# Altium schematic sheet Voltage Indicator.SchDoc
size A4; SheetNumber: 1; SheetTotal: 1
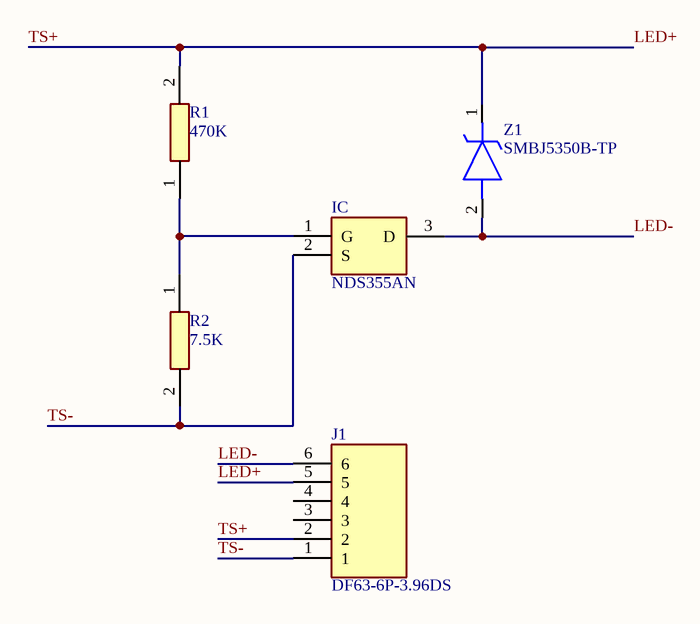
[diagram p0: Voltage Indicator.SchDoc]

## Parts
IC  NDS355AN  [SOT95P251X112-3N]
J1  DF63-6P-3.96DS  [DF636P396DS]
R1  470K  [RESAD1800W63L800D250]
R2  7.5K  [RESAD1800W63L800D250]
Z1  SMBJ5350B-TP  [DIOM5336X261N]

## Nets
LED+: J1.2 J1.5 R1.2 Z1.1(K)  [also labelled TS+]
LED-: IC.3(D) J1.6 Z1.2(A)
TS-: IC.2(S) J1.1 R2.2
NetIC_1: IC.1(G) R1.1 R2.1

Not connected (* = marked no-connect by the designer): J1 3 4

## Library data of the parts
IC = NDS355AN: Integrated Circuit; Manufacturer_Name: onsemi; Datasheet Link: https://www.mouser.de/datasheet/2/308/NDS355AN-D-1813055.pdf; Height: 1.12mm; Manufacturer_Part_Number: NDS355AN; Mouser Part Number: 512-NDS355AN; Mouser Price/Stock: https://www.mouser.co.uk/ProductDetail/ON-Semiconductor-Fairchild/NDS355AN?qs=FOlmdCx%252BAA0yQlAVFAsL8w%3D%3D; Arrow Part Number: NDS355AN; Arrow Price/Stock: https://www.arrow.com/en/products/nds355an/on-semiconductor?region=nac
J1 = DF63-6P-3.96DS: Connector; Manufacturer_Name: Hirose; Height: 10mm; Manufacturer_Part_Number: DF63-6P-3.96DS; Mouser Part Number: 798-DF63-6P-3.96DS; Mouser Price/Stock: https://www.mouser.co.uk/ProductDetail/Hirose-Connector/DF63-6P-396DS?qs=vcbW%252B4%252BSTIpqvfLgfAUSZA%3D%3D
R1 R2 = PR01000104700JR500: Resistor; Manufacturer_Name: Vishay; Datasheet Link: http://www.vishay.com/docs/28729/pr010203.pdf; Manufacturer_Part_Number: PR01000104700JR500; Mouser Part Number: 594-5073NW470R0J; Mouser Price/Stock: https://www.mouser.co.uk/ProductDetail/Vishay-BC-Components/PR01000104700JR500?qs=AI63Xxb%2F5RSGrbRBDk%2F12A%3D%3D
Z1 = SMBJ5350B-TP: Zener Diode; Manufacturer_Name: MCC; Datasheet Link: https://datasheet.datasheetarchive.com/originals/distributors/Datasheets_SAMA/a60ad652ec0afa86ef037664c8e865a3.pdf; Height: 2.61mm; Manufacturer_Part_Number: SMBJ5350B-TP; Mouser Part Number: 833-SMBJ5350B-TP; Mouser Price/Stock: https://www.mouser.co.uk/ProductDetail/Micro-Commercial-Components-MCC/SMBJ5350B-TP?qs=ZNK0BnemlqFnl95cTboLBQ%3D%3D; Arrow Part Number: SMBJ5350B-TP; Arrow Price/Stock: https://www.arrow.com/en/products/smbj5350b-tp/micro-commercial-components